# Altium schematic sheet NET.SchDoc
size A3
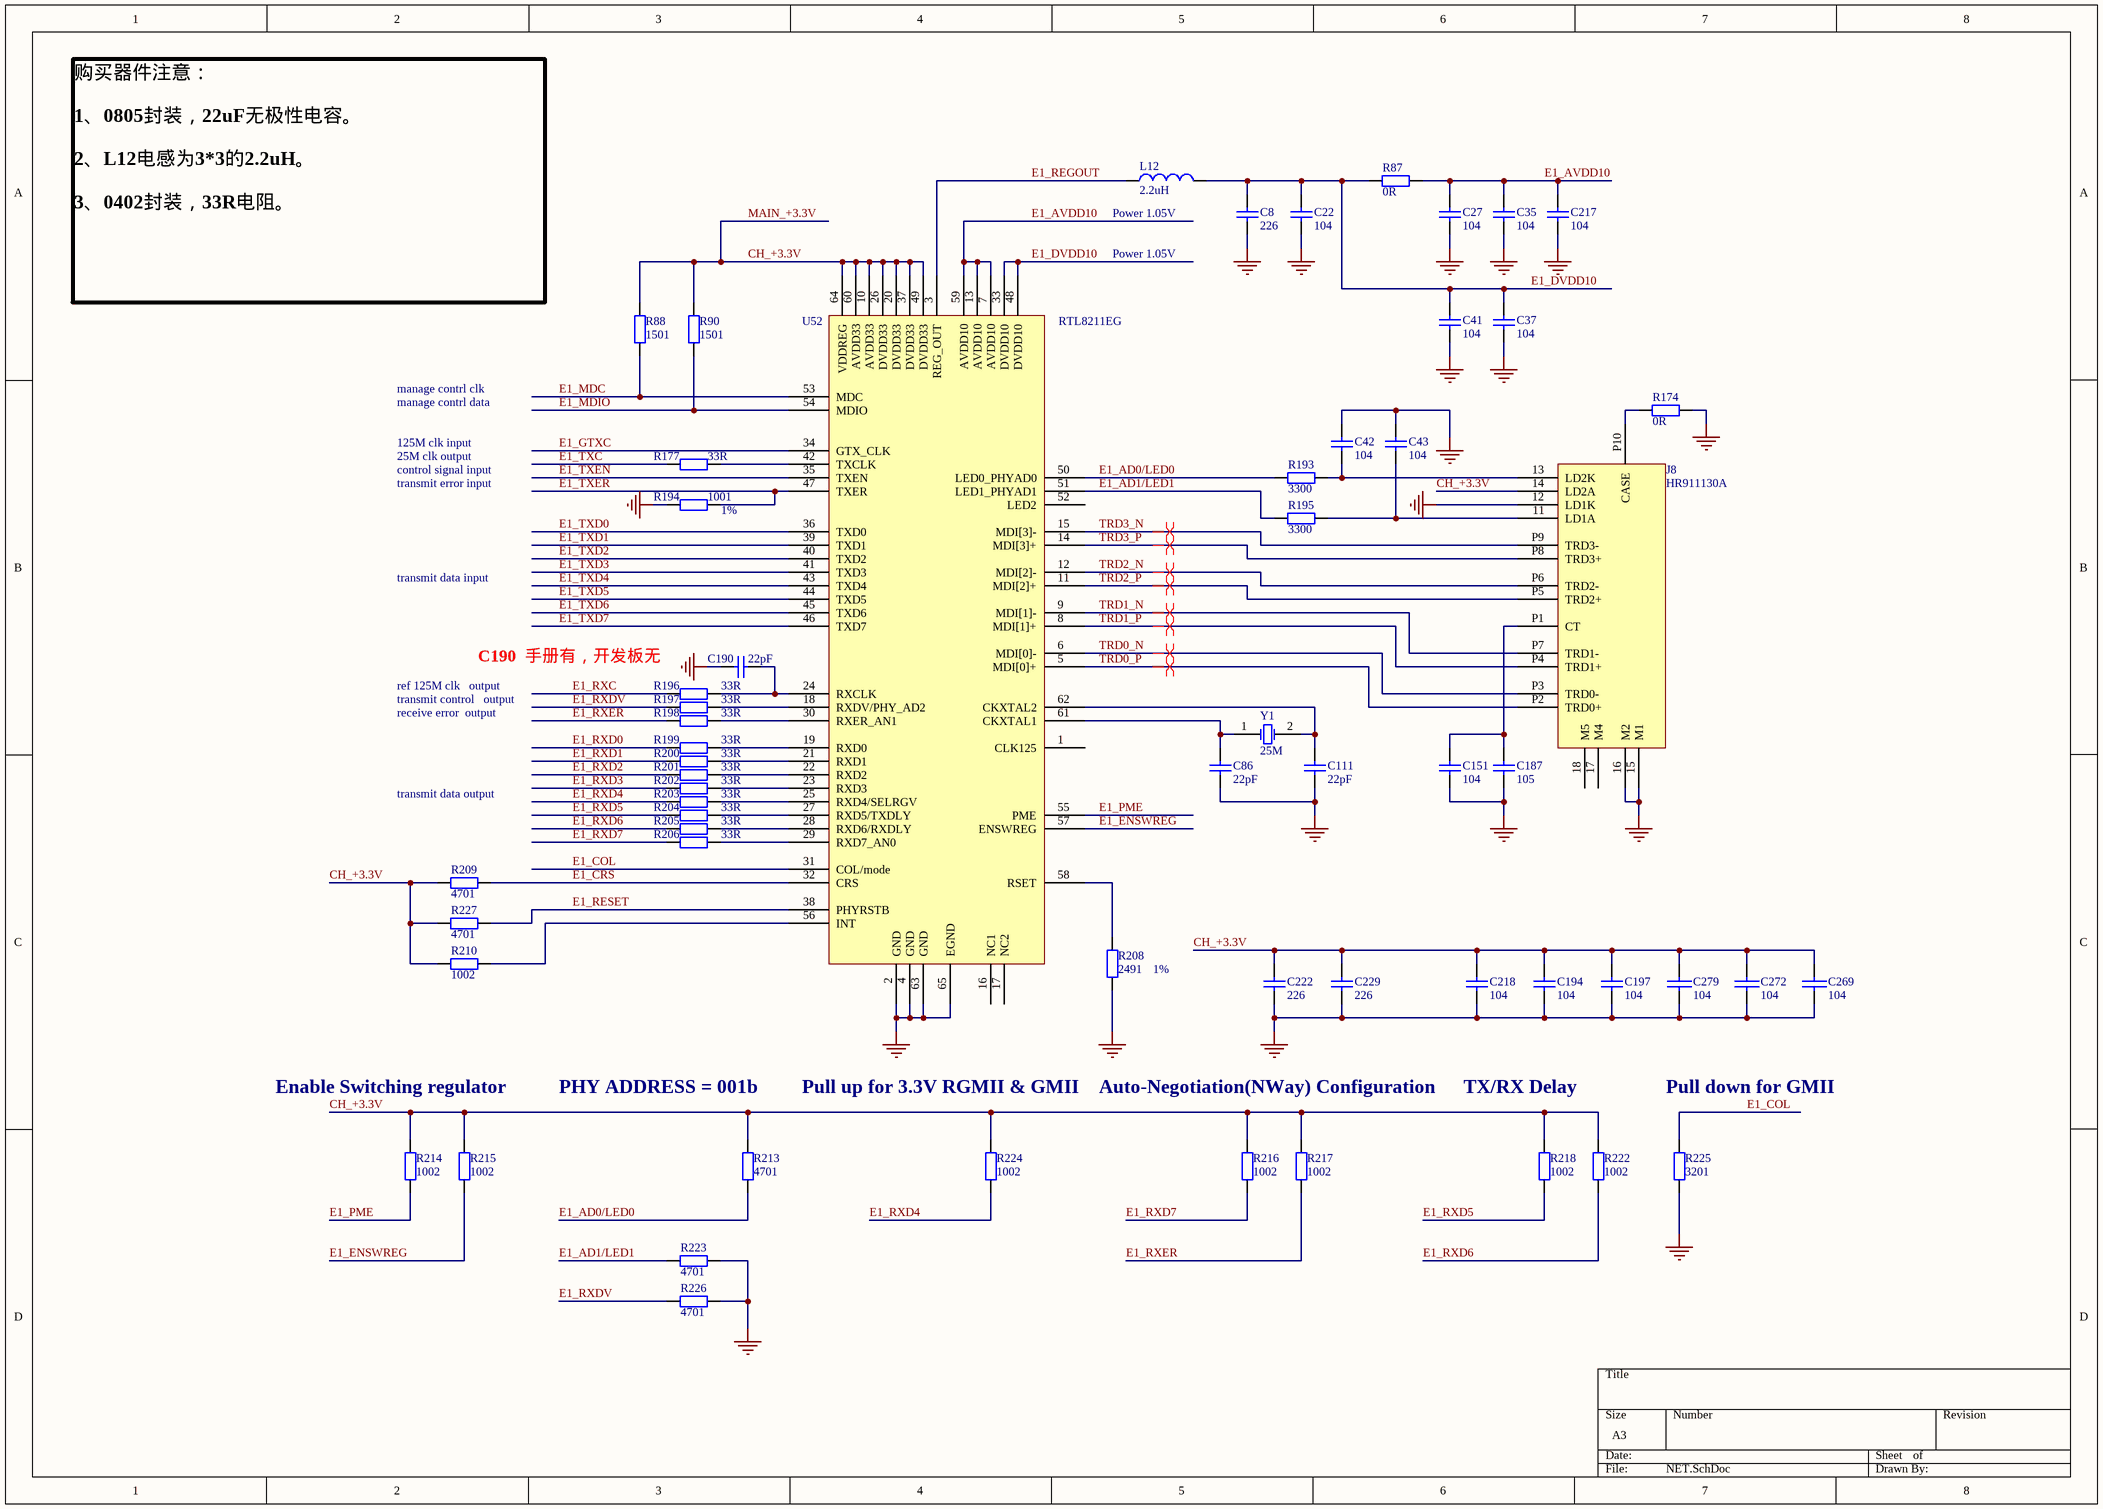
[diagram p0: NET.SchDoc]

## Parts
C8  226  [0805]
C22  104  [0402C]
C27  104  [0402C]
C35  104  [0402C]
C37  104  [0402C]
C41  104  [0402C]
C42  104  [0402C]
C43  104  [0402C]
C86  22pF  [0805]
C111  22pF  [0805]
C151  104  [0402C]
C187  105  [0805]
C190  22pF  [0402]
C194  104  [0402C]
C197  104  [0402C]
C217  104  [0402C]
C218  104  [0402C]
C222  226  [0805]
C229  226  [0805]
C269  104  [0402C]
C272  104  [0402C]
C279  104  [0402C]
J8  HR911130A  [GE_RJ45]
L12  2.2uH  [L22uH]
R87  0R  [R0603]
R88  1501  [R0603]
R90  1501  [R0603]
R174  0R  [R0603]
R177  33R  [0402]
R193  3300  [R0603]
R194  1001  [R0603]
R195  3300  [R0603]
R196  33R  [0402]
R197  33R  [0402]
R198  33R  [0402]
R199  33R  [0402]
R200  33R  [0402]
R201  33R  [0402]
R202  33R  [0402]
R203  33R  [0402]
R204  33R  [0402]
R205  33R  [0402]
R206  33R  [0402]
R208  2491  [R0603]
R209  4701  [R0603]
R210  1002  [R0603]
R213  4701  [R0603]
R214  1002  [R0603]
R215  1002  [R0603]
R216  1002  [R0603]
R217  1002  [R0603]
R218  1002  [R0603]
R222  1002  [R0603]
R223  4701  [R0603]
R224  1002  [R0603]
R225  3201  [R0603]
R226  4701  [R0603]
R227  4701  [R0603]
U52  RTL8211EG  [QFN65-050-0909]
Y1  25M  [XTAL]

## Nets
DGND: C8.2 C22.1 C27.1 C35.1 C37.1 C41.1 C42.2 C43.2 C86.1 C111.1 C151.1 C187.1 C190.2 C194.1 C197.1 C217.1 C218.1 C222.2 C229.2 C269.1 C272.1 C279.1 J8.12(LD1K) J8.15(M1) J8.16(M2) R174.2 R194.2 R208.2 R223.2 R225.1 R226.2 U52.2(GND) U52.4(GND) U52.63(GND) U52.65(EGND)
CH_+3.3V: C194.2 C197.2 C218.2 C222.1 C229.1 C269.2 C272.2 C279.2 J8.14(LD2A) R88.2 R90.2 R209.1 R210.2 R213.2 R214.1 R215.1 R216.1 R217.1 R218.1 R222.1 R224.1 R227.1 U52.10(AVDD33) U52.20(DVDD33) U52.26(DVDD33) U52.37(DVDD33) U52.49(DVDD33) U52.60(AVDD33) U52.64(VDDREG)  [also labelled MAIN_+3.3V]
E1_AD0/LED0: R193.2 R213.1 U52.50(LED0_PHYAD0)
E1_AD1/LED1: R195.2 R223.1 U52.51(LED1_PHYAD1)
E1_AVDD10: C27.2 C35.2 C217.2 R87.1 U52.7(AVDD10) U52.13(AVDD10) U52.59(AVDD10)
E1_COL: R225.2 U52.31(COL/mode)
E1_CRS: R209.2 U52.32(CRS)
E1_DVDD10: C8.1 C22.2 C37.2 C41.2 L12.2 R87.2 U52.33(DVDD10) U52.48(DVDD10)
E1_ENSWREG: R215.2 U52.57(ENSWREG)
E1_GTXC: U52.34(GTX_CLK)
E1_MDC: R88.1 U52.53(MDC)
E1_MDIO: R90.1 U52.54(MDIO)
E1_PME: R214.2 U52.55(PME)
E1_REGOUT: L12.1 U52.3(REG_OUT)
E1_RESET: R227.2 U52.38(PHYRSTB)
E1_RXC: R196.2
E1_RXD0: R199.2
E1_RXD1: R200.2
E1_RXD2: R201.2
E1_RXD3: R202.2
E1_RXD4: R203.2 R224.2
E1_RXD5: R204.1 R218.2
E1_RXD6: R205.2 R222.2
E1_RXD7: R206.2 R216.2
E1_RXDV: R197.2 R226.1
E1_RXER: R198.2 R217.2
E1_TXC: R177.2
E1_TXD0: U52.36(TXD0)
E1_TXD1: U52.39(TXD1)
E1_TXD2: U52.40(TXD2)
E1_TXD3: U52.41(TXD3)
E1_TXD4: U52.43(TXD4)
E1_TXD5: U52.44(TXD5)
E1_TXD6: U52.45(TXD6)
E1_TXD7: U52.46(TXD7)
E1_TXEN: U52.35(TXEN)
E1_TXER: R194.1 U52.47(TXER)
TRD0_N: J8.P3(TRD0-) U52.6(MDI[0]-)
TRD0_P: J8.P2(TRD0+) U52.5(MDI[0]+)
TRD1_N: J8.P7(TRD1-) U52.9(MDI[1]-)
TRD1_P: J8.P4(TRD1+) U52.8(MDI[1]+)
TRD2_N: J8.P6(TRD2-) U52.12(MDI[2]-)
TRD2_P: J8.P5(TRD2+) U52.11(MDI[2]+)
TRD3_N: J8.P9(TRD3-) U52.15(MDI[3]-)
TRD3_P: J8.P8(TRD3+) U52.14(MDI[3]+)
NetC42_1: C42.1 J8.13(LD2K) R193.1
NetC43_1: C43.1 J8.11(LD1A) R195.1
NetC86_2: C86.2 U52.61(CKXTAL1) Y1.1(OSC1)
NetC111_2: C111.2 U52.62(CKXTAL2) Y1.2(OSC2)
NetC151_2: C151.2 C187.2 J8.P1(CT)
NetC190_1: C190.1 R196.1 U52.24(RXCLK)
NetJ8_P10: J8.P10(CASE) R174.1
NetR177_1: R177.1 U52.42(TXCLK)
NetR197_1: R197.1 U52.18(RXDV/PHY_AD2)
NetR198_1: R198.1 U52.30(RXER_AN1)
NetR199_1: R199.1 U52.19(RXD0)
NetR200_1: R200.1 U52.21(RXD1)
NetR201_1: R201.1 U52.22(RXD2)
NetR202_1: R202.1 U52.23(RXD3)
NetR203_1: R203.1 U52.25(RXD4/SELRGV)
NetR204_2: R204.2 U52.27(RXD5/TXDLY)
NetR205_1: R205.1 U52.28(RXD6/RXDLY)
NetR206_1: R206.1 U52.29(RXD7_AN0)
NetR208_1: R208.1 U52.58(RSET)
NetR210_1: R210.1 U52.56(INT)

Not connected (* = marked no-connect by the designer): J8 17(M4) 18(M5); U52 1(CLK125) 16(NC1) 17(NC2) 52(LED2)

## Layout directives
differential pair: TRD0_N, TRD0_P, TRD1_N, TRD1_P, TRD2_N, TRD2_P, TRD3_N, TRD3_P

## Notes on the sheet
- (near L12) Power 1.05V
- 购买器件注意：
  1、0805封装，22uF无极性电容。
  2、L12电感为3*3的2.2uH。
  3、0402封装，33R电阻。
- Power 1.05V
- manage contrl clk
- manage contrl data
- 125M clk input
- 25M clk output
- control signal input
- transmit error input
- (near R194) 1%
- transmit data input
- ref 125M clk   output
- transmit control   output
- receive error  output
- C190  手册有，开发板无
- transmit data output
- (near R208) 1%
- Enable Switching regulator
- PHY ADDRESS = 001b
- Pull up for 3.3V RGMII & GMII
- Auto-Negotiation(NWay) Configuration
- TX/RX Delay
- Pull down for GMII

## Library data of the parts
C8 C22 C27 C35 C37 C41-C43 C86 C111 C151 C187 C190 C194 C197 C217 C218 C222 C229 = Cap: Capacitor; Published: 8-Jun-2000; LatestRevisionDate: 17-Jul-2002; LatestRevisionNote: Re-released for DXP Platform.; PackageReference: RAD-0.3; Publisher: Altium Limited
  C8 C222 C229: Value: 226
  C22 C27 C35 C37 C41-C43 C151 C194 C197 C217 C218: Value: 104
  C86 C111 C190: Value: 22pF
  C187: Value: 105
C269 C272 C279 = CAP: Capacitor
L12 = Inductor: Code_IEC: 1005; Published: 8-Jun-2000; LatestRevisionDate: 29-May-2009; LatestRevisionNote: IPC-7351 Footprint Added.; PackageReference: 0402-A; Publisher: Altium Limited; PackageDescription: Chip Inductor; Code_JEITA: 0402; Value: 2.2uH
R87 R88 R90 R174 R177 R193-R206 R208-R210 R213-R218 R222-R227 = Res2: Resistor; Published: 8-Jun-2000; LatestRevisionDate: 17-Jul-2002; LatestRevisionNote: Re-released for DXP Platform.; PackageReference: AXIAL-0.4; Publisher: Altium Limited
  R87 R174: Value: 0R
  R88 R90: Value: 1501
  R177 R196-R206: Value: 33R
  R193 R195: Value: 3300
  R194: Value: 1001
  R208: Value: 2491
  R209 R213 R223 R226 R227: Value: 4701
  R210 R214-R218 R222 R224: Value: 1002
  R225: Value: 3201
Y1 = XTAL: Crystal Oscillator; Published: 8-Jun-2000; LatestRevisionDate: 17-Jul-2002; LatestRevisionNote: Re-released for DXP Platform.; PackageReference: R38; Publisher: Altium Limited